# Altium schematic sheet InputOutput.SchDoc: Okosotthon vezérlő HAT
size A4; Author: Bencsik Dániel Zoltán; Organization: BME VIK AUT; DocumentNumber: 4; SheetNumber: 4; SheetTotal: 4
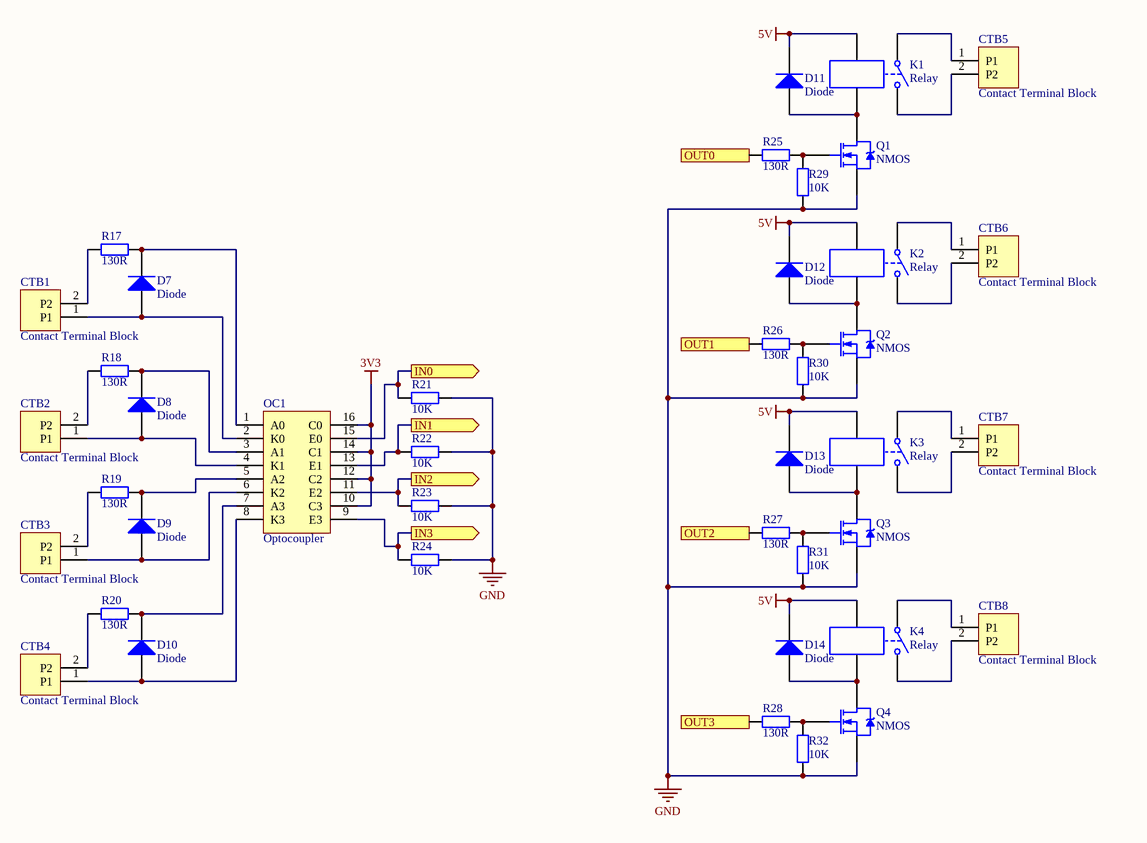
[diagram p0: InputOutput.SchDoc]

## Parts
CTB1  Contact Terminal Block  [ONLAB_SORK_2_RN3.50]
CTB2  Contact Terminal Block  [ONLAB_SORK_2_RN3.50]
CTB3  Contact Terminal Block  [ONLAB_SORK_2_RN3.50]
CTB4  Contact Terminal Block  [ONLAB_SORK_2_RN3.50]
CTB5  Contact Terminal Block  [ONLAB_SORK_2_RN3.50]
CTB6  Contact Terminal Block  [ONLAB_SORK_2_RN3.50]
CTB7  Contact Terminal Block  [ONLAB_SORK_2_RN3.50]
CTB8  Contact Terminal Block  [ONLAB_SORK_2_RN3.50]
D7  Diode  [ONLAB_SMA_DO-214AC]
D8  Diode  [ONLAB_SMA_DO-214AC]
D9  Diode  [ONLAB_SMA_DO-214AC]
D10  Diode  [ONLAB_SMA_DO-214AC]
D11  Diode  [ONLAB_SMA_DO-214AC]
D12  Diode  [ONLAB_SMA_DO-214AC]
D13  Diode  [ONLAB_SMA_DO-214AC]
D14  Diode  [ONLAB_SMA_DO-214AC]
K1  Relay  [ONLAB_RELAY_ALQ305]
K2  Relay  [ONLAB_RELAY_ALQ305]
K3  Relay  [ONLAB_RELAY_ALQ305]
K4  Relay  [ONLAB_RELAY_ALQ305]
OC1  Optocoupler  [ONLAB_OPTO_TLP290-4]
Q1  NMOS  [ONLAB_2N7002_SOT23127P600-8N]
Q2  NMOS  [ONLAB_2N7002_SOT23127P600-8N]
Q3  NMOS  [ONLAB_2N7002_SOT23127P600-8N]
Q4  NMOS  [ONLAB_2N7002_SOT23127P600-8N]
R17  130R  [FP_0805_RES]
R18  130R  [FP_0805_RES]
R19  130R  [FP_0805_RES]
R20  130R  [FP_0805_RES]
R21  10K  [FP_0805_RES]
R22  10K  [FP_0805_RES]
R23  10K  [FP_0805_RES]
R24  10K  [FP_0805_RES]
R25  130R  [FP_0805_RES]
R26  130R  [FP_0805_RES]
R27  130R  [FP_0805_RES]
R28  130R  [FP_0805_RES]
R29  10K  [FP_0805_RES]
R30  10K  [FP_0805_RES]
R31  10K  [FP_0805_RES]
R32  10K  [FP_0805_RES]

## Ports
IN0 (out), IN1 (out), IN2 (out), IN3 (out), OUT0 (in), OUT1 (in), OUT2 (in), OUT3 (in)

## Nets
3V3: OC1.10(C3) OC1.12(C2) OC1.14(C1) OC1.16(C0)
5V: D11.2(K) D12.2(K) D13.2(K) D14.2(K) K1.3 K2.3 K3.3 K4.3
GND: Q1.3(S) Q2.3(S) Q3.3(S) Q4.3(S) R21.2 R22.2 R23.2 R24.2 R29.1 R30.1 R31.1 R32.1
IN0: OC1.15(E0) R21.1 ; port IN0
IN1: OC1.13(E1) R22.1 ; port IN1
IN2: OC1.11(E2) R23.1 ; port IN2
IN3: OC1.9(E3) R24.1 ; port IN3
OUT0: R25.1 ; port OUT0
OUT1: R26.1 ; port OUT1
OUT2: R27.1 ; port OUT2
OUT3: R28.1 ; port OUT3
NetCTB1_1: CTB1.1(P1) D7.1(A) OC1.2(K0)
NetCTB1_2: CTB1.2(P2) R17.1
NetCTB2_1: CTB2.1(P1) D8.1(A) OC1.4(K1)
NetCTB2_2: CTB2.2(P2) R18.1
NetCTB3_1: CTB3.1(P1) D9.1(A) OC1.6(K2)
NetCTB3_2: CTB3.2(P2) R19.1
NetCTB4_1: CTB4.1(P1) D10.1(A) OC1.8(K3)
NetCTB4_2: CTB4.2(P2) R20.1
NetCTB5_1: CTB5.1(P1) K1.1
NetCTB5_2: CTB5.2(P2) K1.2
NetCTB6_1: CTB6.1(P1) K2.1
NetCTB6_2: CTB6.2(P2) K2.2
NetCTB7_1: CTB7.1(P1) K3.1
NetCTB7_2: CTB7.2(P2) K3.2
NetCTB8_1: CTB8.1(P1) K4.1
NetCTB8_2: CTB8.2(P2) K4.2
NetD7_2: D7.2(K) OC1.1(A0) R17.2
NetD8_2: D8.2(K) OC1.3(A1) R18.2
NetD9_2: D9.2(K) OC1.5(A2) R19.2
NetD10_2: D10.2(K) OC1.7(A3) R20.2
NetD11_1: D11.1(A) K1.4 Q1.2(D)
NetD12_1: D12.1(A) K2.4 Q2.2(D)
NetD13_1: D13.1(A) K3.4 Q3.2(D)
NetD14_1: D14.1(A) K4.4 Q4.2(D)
NetQ1_1: Q1.1(G) R25.2 R29.2
NetQ2_1: Q2.1(G) R26.2 R30.2
NetQ3_1: Q3.1(G) R27.2 R31.2
NetQ4_1: Q4.1(G) R28.2 R32.2

## Notes on the sheet
- Title
- Size:
- Date:
- A4
- Number:
- Time:
- Revision:
- Sheet
- of
- File:

## Library data of the parts
CTB1-CTB8 = CTB: SORKAPOCS 2 P RM3.50 CPP3.5/2 (STE) LIFTES 1mmř 10A
D7-D14 = Diode: Default Diode; pin to pad: 1>A 2>K; Published: 8-Jun-2000; LatestRevisionDate: 17-Jul-2002; LatestRevisionNote: Re-released for DXP Platform.; PackageVersion: Sep-1996; PackageReference: SMC; Publisher: Altium Limited; PackageDescription: DO-214-AB/SMC; 2 C-Bend Leads; Body 7.9 x 5.9 mm, inc. leads (LxW); Code_JEDEC: DO-214-AB
K1-K4 = Relay-SPST: Single-Pole Single-Throw Relay; pin to pad: 1>COM 2>NO 3>C2 4>C1; Published: 24-Mar-1999; LatestRevisionDate: 17-Jul-2002; LatestRevisionNote: Re-released for DXP Platform.; PackageReference: MODULE4; Publisher: Altium Limited
OC1 = Optocoupler: TLP293-4 TOSHIBA PHOTOCOUPLER InGaAs IRED & PHOTO-TRANSISTOR
Q1-Q4 = NMOS: NXP - BSP030,115 - MOSFET, N CH, 30V, 10A, SOT223; pin to pad: 1>G 2>D 3>S
R17-R32 = RES: Resistor
  R17-R20 R25-R28: Value: 130R
  R21-R24 R29-R32: Value: 10K